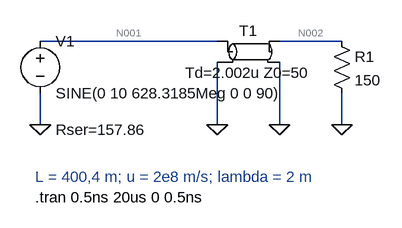
[diagram p0: schematic Q2.asc]
Q2.asc, the LTspice schematic file:
Version 4
SHEET 1 880 700
WIRE 144 128 -128 128
WIRE 336 128 240 128
WIRE -128 256 -128 208
WIRE 144 256 144 160
WIRE 240 256 240 160
WIRE 336 256 336 208
FLAG -128 256 0
FLAG 144 256 0
FLAG 240 256 0
FLAG 336 256 0
SYMBOL tline 192 144 R0
SYMATTR InstName T1
SYMATTR Value Td=2.002u Z0=50
SYMBOL res 320 112 R0
SYMATTR InstName R1
SYMATTR Value 150
SYMBOL voltage -128 112 R0
WINDOW 123 24 124 Left 2
WINDOW 39 24 152 Left 2
SYMATTR SpiceLine Rser=157.86
SYMATTR InstName V1
SYMATTR Value SINE(0 10 628.3185Meg 0 0 90)
TEXT -136 336 Left 2 ;L = 400,4 m; u = 2e8 m/s; lambda = 2 m
TEXT -136 368 Left 2 !.tran 0.5ns 20us 0 0.5ns

The netlist it stands for:
* Q2.asc
T1 N001 0 N002 0 Td=2.002u Z0=50
R1 N002 0 150
V1 N001 0 SINE(0 10 628.3185Meg 0 0 90) Rser=157.86
* L = 400,4 m; u = 2e8 m/s; lambda = 2 m
.tran 0.5ns 20us 0 0.5ns
.backanno
.end

* Results of the author's LTspice run, read from the files saved beside the schematic
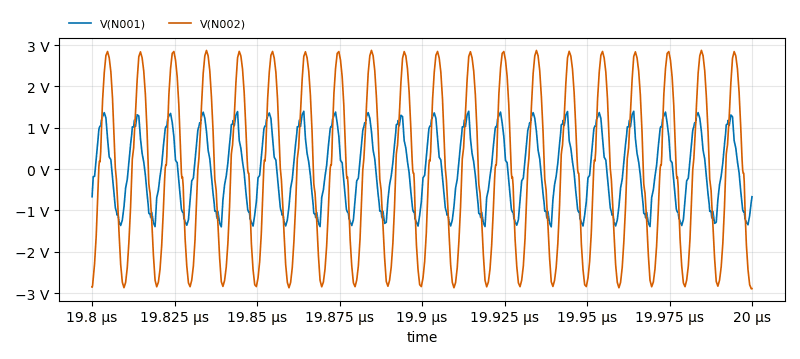
[diagram p1: Transient Analysis of Q2.asc, plotted from the saved traces]
* Transient Analysis, 1 run:
*   V(N001): min -1.398 V, max 1.398 V, average -602.9 µV, rms 908.3 mV, last -669.4 mV
*   V(N002): min -2.896 V, max 2.871 V, average -616.2 µV, rms 1.998 V, last -2.892 V